# Altium schematic sheet FDC1004DGST.SchDoc: FDC1004DGST Capasitive Sensor
size A4; DrawnBy: Sanju Prakash Kannioth; Engineer: Sanju Prakash Kannioth; Revision: 1.0; SheetNumber: 7; SheetTotal: 10
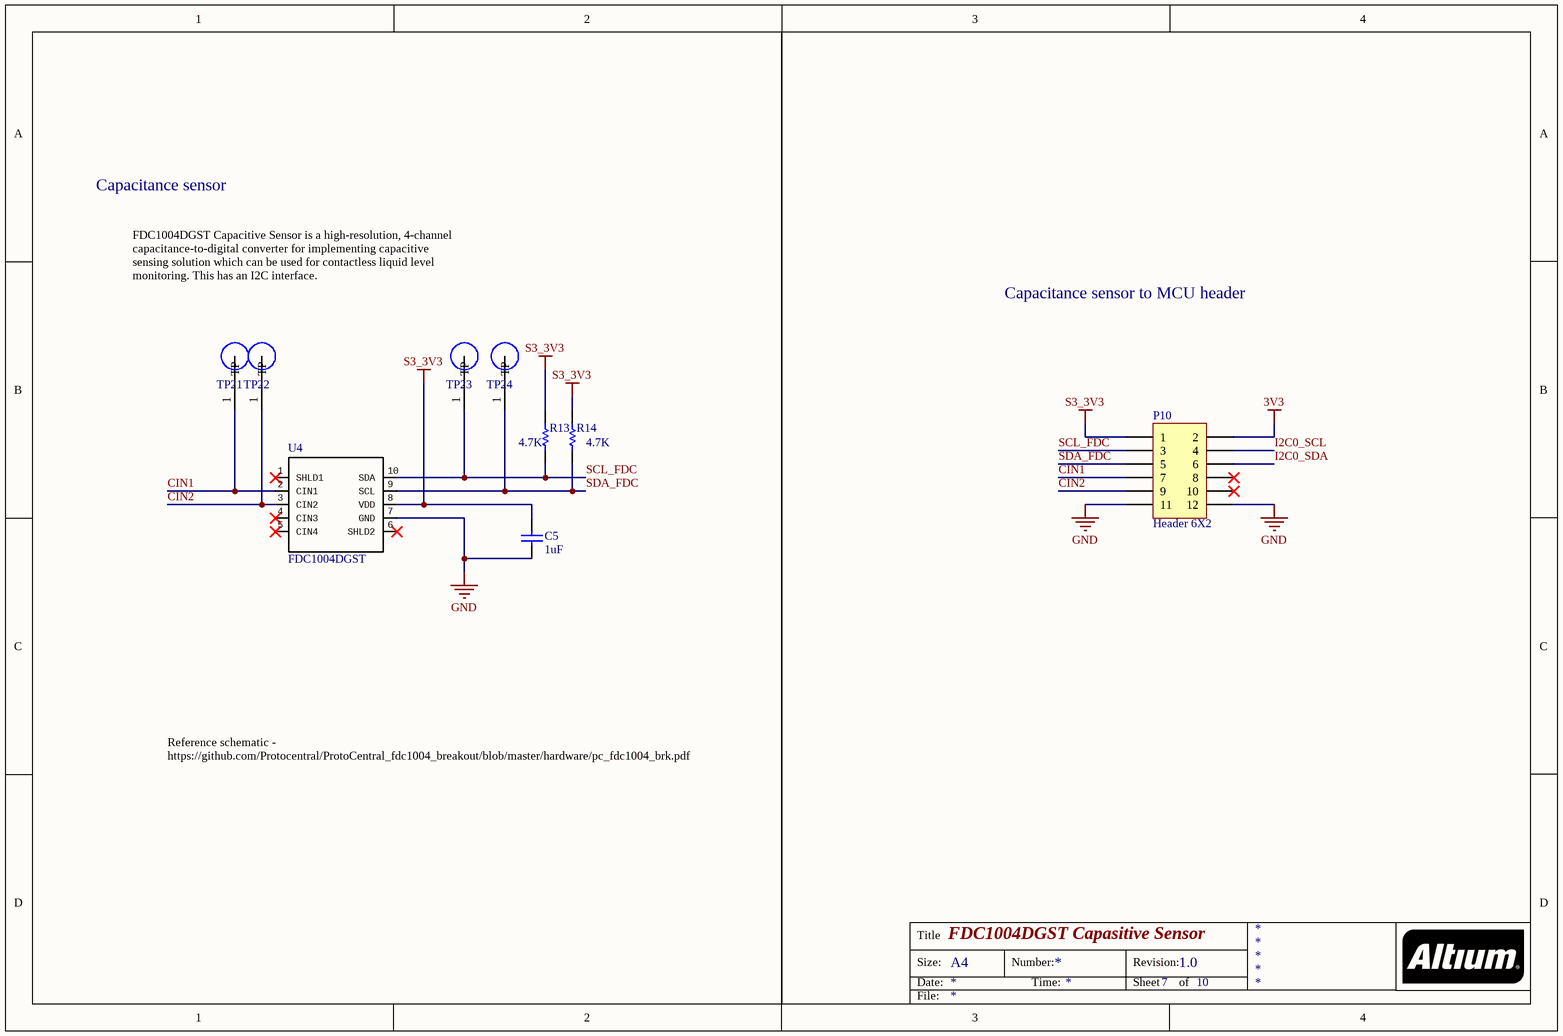
[diagram p0: FDC1004DGST.SchDoc]

## Parts
C5  value 1uF  [1608[0603]]  (hidden comment: Cap)
P10  Header 6X2  [HDR2X6]
R13  value 4.7K  [1608[0603]]  (hidden comment: Res1)
R14  value 4.7K  [1608[0603]]  (hidden comment: Res1)
TP21  TP  [TP]  (value not drawn)
TP22  TP  [TP]  (value not drawn)
TP23  TP  [TP]  (value not drawn)
TP24  TP  [TP]  (value not drawn)
U4  FDC1004DGST  [FDC1004DGST]

## Nets
3V3: P10.2
GND: C5.1 P10.11 P10.12 U4.7(GND)
S3_3V3: C5.2 P10.1 R13.2 R14.2 U4.8(VDD)
CIN1: P10.7 TP21.1(TP) U4.2(CIN1)
CIN2: P10.9 TP22.1(TP) U4.3(CIN2)
I2C0_SCL: P10.4
I2C0_SDA: P10.6
SCL_FDC: P10.3 R13.1 TP23.1(TP) U4.10(SDA)
SDA_FDC: P10.5 R14.1 TP24.1(TP) U4.9(SCL)

Not connected (* = marked no-connect by the designer): P10 8* 10*; U4 1(SHLD1)* 4(CIN3)* 5(CIN4)* 6(SHLD2)*

## Notes on the sheet
- Capacitance sensor
- FDC1004DGST Capacitive Sensor is a high-resolution, 4-channel capacitance-to-digital converter for implementing capacitive sensing solution which can be used for contactless liquid level monitoring. This has an I2C interface.
- Capacitance sensor to MCU header
- Reference schematic - https://github.com/Protocentral/ProtoCentral_fdc1004_breakout/blob/master/hardware/pc_fdc1004_brk.pdf
- Title
- Size:
- Date:
- A4
- Number:
- Time:
- Revision:
- Sheet
- of
- File:

## Library data of the parts
C5 = Cap: Capacitor; Manufacturer: Samsung Electro-Mechanics; Manufacturer Part Number: CL10B105MO8NNWC; Digi-Key Part Number: 1276-6524-1-ND; DigiKeyURL: https://www.digikey.com/product-detail/en/samsung-electro-mechanics/CL10B105MO8NNWC/1276-6524-1-ND/5961383
P10 = Header 6X2: Header, 6-Pin, Dual row; Manufacturer Part Number: 67997-212HLF; Manufacturer: Amphenol ICC (FCI); DigiKeyURL: https://www.digikey.com/product-detail/en/amphenol-icc-fci/67997-212HLF/609-3237-ND/1878564; Digi-Key Part Number: 609-3237-ND
R13 R14 = Res1: RES SMD 4.7K OHM 5% 1/10W 0603; Manufacturer: Yageo; Manufacturer Part Number: RC0603JR-074K7L; Digi-Key Part Number: 311-4.7KGRCT-ND; DigiKeyURL: https://www.digikey.com/product-detail/en/yageo/RC0603JR-074K7L/311-4.7KGRCT-ND/729732
TP21-TP24 = TP: PC TEST POINT MINIATURE; Manufacturer: Keystone Electronics; Manufacturer Part Number: 5019; Snapeda_Url: https://www.snapeda.com/parts/5019/Keystone%20Electronics/view-part/?ref=search&t=5019; DigiKeyURL: https://www.digikey.com/product-detail/en/keystone-electronics/5019/36-5019CT-ND/3907344?utm_source=snapeda&utm_medium=aggregator&utm_campaign=symbol; Digi-Key Part Number: 36-5019CT-ND
U4 = FDC1004DGST: CAPACITIVE SENSING SOLUTIONS; Manufacturer: Texas Instruments; Digi-Key Part Number: 296-49639-1-ND; Manufacturer Part Number: FDC1004DGST; DigiKeyURL: https://www.digikey.com/products/en/integrated-circuits-ics/interface-sensor-capacitive-touch/560?k=FDC1004DGST&k=&pkeyword=FDC1004DGST&sv=0&pv7=2&sf=0&quantity=&ColumnSort=0&page=1&stock=1&datasheet=1&pageSize=25; Snapeda_URL: https://www.snapeda.com/parts/FDC1004DGST/Texas%20Instruments/view-part/?ref=search&t=FDC1004DGST